# Altium project SSM2044_Filter.PrjPcb
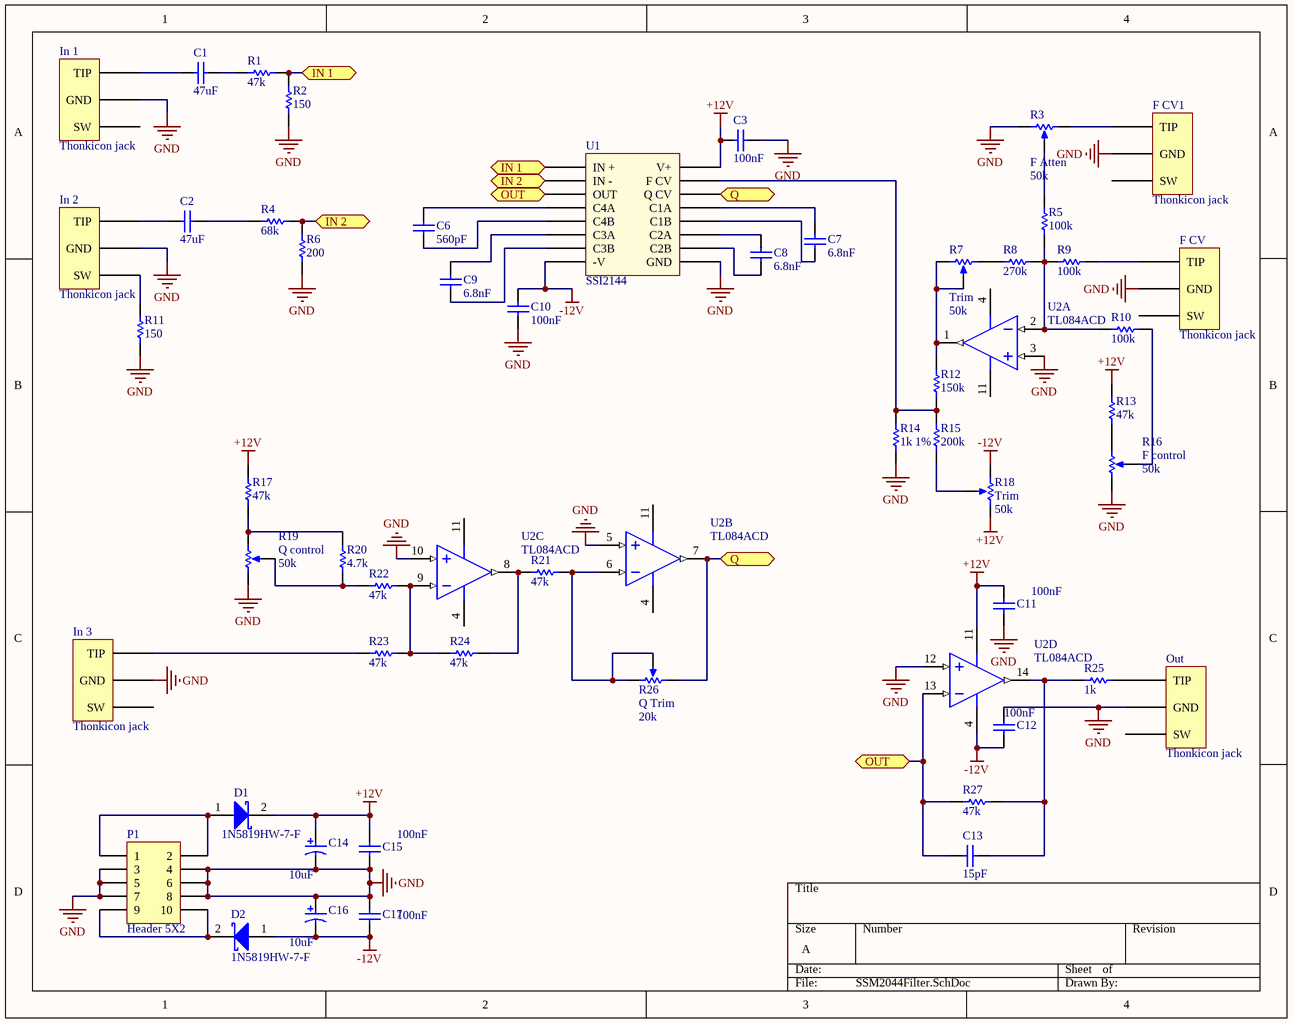
[diagram p0: SSM2044Filter.SchDoc]
1 sheet, 53 parts. Net scope: flat (ports and power ports of the same name join across sheets).

## Sheet SSM2044Filter.SchDoc
size A

### Parts
C1  47uF  [CAPC0603(1608)100_M]
C2  47uF  [CAPC0603(1608)100_M]
C3  100nF  [CAPC0603(1608)100_M]
C6  560pF  [CAPC0603(1608)100_M]
C7  6.8nF  [CAPC0603(1608)100_M]
C8  6.8nF  [CAPC0603(1608)100_M]
C9  6.8nF  [CAPC0603(1608)100_M]
C10  100nF  [CAPC0603(1608)100_M]
C11  100nF  [CAPC0603(1608)100_M]
C12  100nF  [CAPC0603(1608)100_M]
C13  15pF  [CAPC0603(1608)100_M]
C14  10uF  [NIC-CAPA2-4X5.8_V]
C15  100nF  [CAPC0603(1608)100_M]
C16  10uF  [NIC-CAPA2-4X5.8_V]
C17  100nF  [CAPC0603(1608)100_M]
D1  1N5819HW-7-F  [DIOD-SOD-123-2_V]
D2  1N5819HW-7-F  [DIOD-SOD-123-2_V]
F_CV  Thonkicon jack  [Thonkiconn Pot PJ301M]
F_CV1  Thonkicon jack  [Thonkiconn Pot PJ301M]
In_1  Thonkicon jack  [Thonkiconn Pot PJ301M]
In_2  Thonkicon jack  [Thonkiconn Pot PJ301M]
In_3  Thonkicon jack  [Thonkiconn Pot PJ301M]
Out  Thonkicon jack  [Thonkiconn Pot PJ301M]
P1  Header 5X2  [HDR2X5]
R1  47k  [RESC0603(1608)_M]
R2  150  [RESC0603(1608)_M]
R3  F Atten  value 50k  [VR5]
R4  68k  [RESC0603(1608)_M]
R5  100k  [RESC0603(1608)_M]
R6  200  [RESC0603(1608)_M]
R7  Trim  value 50k  [VR5]
R8  270k  [RESC0603(1608)_M]
R9  100k  [RESC0603(1608)_M]
R10  100k  [RESC0603(1608)_M]
R11  150  [RESC0603(1608)_M]
R12  150k  [RESC0603(1608)_M]
R13  47k  [RESC0603(1608)_M]
R14  1k 1%  [RESC0603(1608)_M]
R15  200k  [RESC0603(1608)_M]
R16  F control  value 50k  [VR5]
R17  47k  [RESC0603(1608)_M]
R18  Trim  value 50k  [VR5]
R19  Q control  value 50k  [VR5]
R20  4.7k  [RESC0603(1608)_M]
R21  47k  [RESC0603(1608)_M]
R22  47k  [RESC0603(1608)_M]
R23  47k  [RESC0603(1608)_M]
R24  47k  [RESC0603(1608)_M]
R25  1k  [RESC0603(1608)_M]
R26  Q Trim  value 20k  [VR5]
R27  47k  [RESC0603(1608)_M]
U1  SSI2144
U2  TL084ACD  [D0014A_M]  (parts A,B,C,D of 4)

### Ports
IN 1, IN 2, OUT, Q

### Nets
+12V: C3.1 C11.1 C14.1 C15.1 D1.2(K) R13.1 R17.2 R18.2(BOT) U1.16(V+) U2.11(VCC-)
-12V: C10.2 C12.2 C16.2 C17.2 D2.1(A) R18.1(TOP) U1.8(-V) U2.4(VCC+)
GND: C3.2 C10.1 C11.2 C12.1 C14.2 C15.2 C16.1 C17.1 F_CV.1(GND) F_CV1.1(GND) In_1.1(GND) In_2.1(GND) In_3.1(GND) Out.1(GND) P1.3 P1.4 P1.5 P1.6 P1.7 P1.8 R2.2 R3.1(TOP) R6.2 R11.2 R14.2 R16.1(TOP) R19.1(TOP) U1.9(GND) U2.3(IN1+) U2.5(IN2+) U2.10(IN3+) U2.12(IN4+)
NetC1_1: C1.1 R1.2
NetC1_2: C1.2 In_1.3(TIP)
NetC2_1: C2.1 R4.2
NetC2_2: C2.2 In_2.3(TIP)
NetC6_1: C6.1 U1.5(C4B)
NetC6_2: C6.2 U1.4(C4A)
NetC7_1: C7.1 U1.12(C1B)
NetC7_2: C7.2 U1.13(C1A)
NetC8_1: C8.1 U1.11(C2A)
NetC8_2: C8.2 U1.10(C2B)
NetC9_1: C9.1 U1.7(C3B)
NetC9_2: C9.2 U1.6(C3A)
NetC13_1: C13.1 R25.2 R27.1 U2.14(OUT4)
NetC13_2: C13.2 R27.2 U1.3(OUT) U2.13(IN4-) ; port OUT
NetD1_1: D1.1(A) P1.1 P1.2
NetD2_2: D2.2(K) P1.9 P1.10
NetF_CV1_3: F_CV1.3(TIP) R3.2(BOT)
NetF_CV_3: F_CV.3(TIP) R9.2
NetIn_2_2: In_2.2(SW) R11.1
NetIn_3_3: In_3.3(TIP) R23.2
NetOut_3: Out.3(TIP) R25.1
NetR1_1: R1.1 R2.1 U1.1(IN_+) ; port IN 1
NetR3_3: R3.3(TAP) R5.2
NetR4_1: R4.1 R6.1 U1.2(IN_-) ; port IN 2
NetR5_1: R5.1 R8.2 R9.1 R10.1 U2.2(IN1-)
NetR7_1: R7.1(TOP) R7.3(TAP) R12.1 U2.1(OUT1)
NetR7_2: R7.2(BOT) R8.1
NetR10_2: R10.2 R16.3(TAP)
NetR12_2: R12.2 R14.1 R15.1 U1.15(F_CV)
NetR13_2: R13.2 R16.2(BOT)
NetR15_2: R15.2 R18.3(TAP)
NetR17_1: R17.1 R19.2(BOT) R20.2
NetR19_3: R19.3(TAP) R20.1 R22.2
NetR21_1: R21.1 R26.2(BOT) R26.3(TAP) U2.6(IN2-)
NetR21_2: R21.2 R24.1 U2.8(OUT3)
NetR22_1: R22.1 R23.1 R24.2 U2.9(IN3-)
NetR26_1: R26.1(TOP) U1.14(Q_CV) U2.7(OUT2) ; port Q

Not connected (* = marked no-connect by the designer): F_CV 2(SW); F_CV1 2(SW); In_1 2(SW); In_3 2(SW); Out 2(SW)

### Library data of the parts
C1 C2 = CMP-1035-00002-1: CAP; Mfr: Nichicon; Mfr_Pn: UEP1E470MED; Distributor: Mouser; Distributor_Pn: 647-UEP1E470MED
C3 C10-C12 C15 C17 = CMP-1035-00002-1: CAP; Mfr: AVX; Mfr_Pn: MM035C104KCZ2A; Distributor: Mouser; Distributor_Pn: 581-MM035C104KCZ2A
C6-C9 C13 = CMP-1035-00002-1: CAP; Mfr: AVX; Distributor: Mouser
C14 C16 = CMP-0687-00016-1: Aluminum Electrolytic Capacitor, UD Series, Low Impedance, 10 uF, 25 V, + / - 20%, -55 to 105 degC, Chip Type, 4 x 5.8 mm D x L, Pb-Free, Reel; Mfr: Nichicon; Mfr_Pn: UUD1E100MCL1GS; Distributor: Mouser; Distributor_Pn: 647-UUD1E100MCL
D1 D2 = CMP-0303-00003-1: 1.0 A Surface Mount Schottky Barrier Rectifier, 40 V, -65 to 125 degC, 2-Pin SOD-123 Package, RoHS, Tape and Reel; Mfr: Diodes Inc.; Distributor: Mouser; Distributor_Pn: 621-1N5819HW-F; Mfr_Pn: 1N5819HW-7-F
P1 = Header 5X2: Header, 5-Pin, Dual row; Ditributor_Pn: 855-M20-9980545; LatestRevisionDate: 17-Jul-2002; LatestRevisionNote: Re-released for DXP Platform.; Publisher: Altium Limited
R1 R2 R4-R6 R8-R15 R17 R20-R25 R27 = CMP-1012-00002-1: Res; Mfr: Susumu; Case-EIA: 0603; Tolerance: 5 %; Distributor: Mouser
  R1 R13 R17 R21-R24 R27: Value: 47k
  R2 R11: Value: 150
  R4: Value: 68k
  R5 R9 R10: Value: 100k
  R6: Value: 200
  R8: Value: 270k
  R12: Value: 150k
  R14: Value: 1k 1%
  R15: Value: 200k
  R20: Value: 4.7k
  R25: Value: 1k
R3 R7 R16 R18 R19 R26 = RPot: Potentiometer; Sim Note: Enter the Resistance value and the set point into parameter fields.; Set Position: 0.5; Published: 8-Jun-2000; LatestRevisionDate: 17-Jul-2002; LatestRevisionNote: Re-released for DXP Platform.; PackageReference: VR5; Publisher: Altium Limited; PackageDescription: Variable Resistor, Thru-Hole; 3 Leads
U2 = CMP-0017-00182-2: JFET-Input Operational Amplifier, 7 to 36 V, 0 to 70 degC, 14-pin SOIC (D14), Green (RoHS & no Sb/Br); Manufacturer: Texas Instruments; GBW(Typ)(MHz): 3; Rating: Catalog; CMRR(Min)(dB): 75; Vio (25C)(Max)(mV): 6; Total Supply Voltage(Max)(+5V is 5, +/-5V is 10): 36; Vn at 1kHz(Typ)(nV/rtHz): 18; Iq per channel(Max)(mA): 2.8; IIB(Max)(pA): 200; Number of Channels: 4; Slew Rate(Typ)(V/us): 13; Sub Family: General Purpose Amplifier, High Supply Voltage Amplifier (>=30V); Total Supply Voltage(Min)(+5V is 5, +/-5V is 10): 7; PackageReference: D0014A; ComponentLink1Description: Manufacturer URL; PartNumber: TL084ACD; ComponentLink2Description: Datasheet; PackageVersion: 4040047-5/M, 06/2011; Mounting Technology: Surface Mount; PackageDescription: 14-Pin Plastic Small Outline, Body 8.65 x 3.90 mm, Pitch 1.27 mm; Offset Drift(Typ)(uV/C): 18; ComponentLink3URL: http://www.ti.com/lit/ml/mpds177g/mpds177g.pdf; DatasheetVersion: SLOS081G; ComponentLink3Description: Package Specification; ComponentLink2URL: http://www.ti.com/lit/ds/symlink/tl084a.pdf; ComponentLink1URL: http://www.ti.com/; Eco-Plan: Green (RoHS & no Sb/Br); Code_JEDEC: MS-012